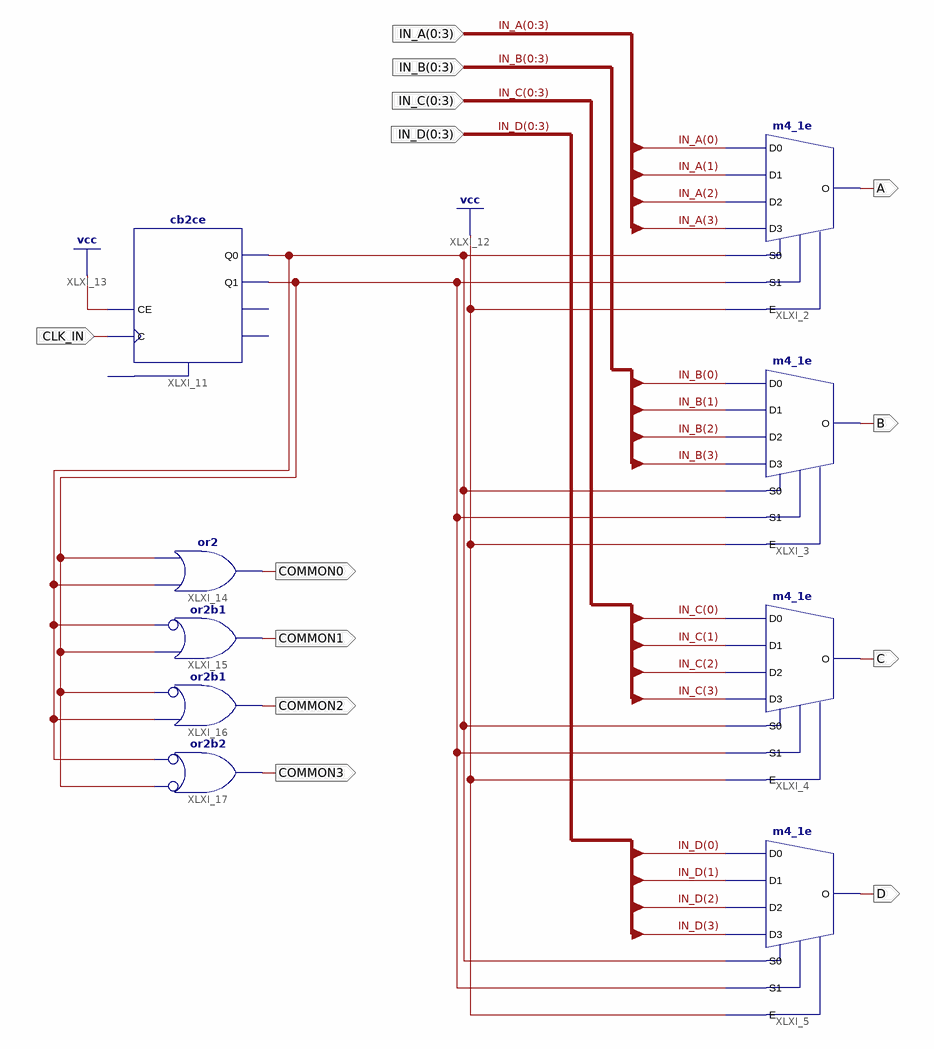
[diagram p0: schematic sheet 1]
// Xilinx ISE schematic CommonSelect.sch (spartan6) as structural Verilog: 9 symbols, 13 ports
module CommonSelect (
  input  [0:3] IN_A,
  input  [0:3] IN_B,
  input  [0:3] IN_D,
  input  [0:3] IN_C,
  input  CLK_IN,
  output COMMON0,
  output COMMON1,
  output COMMON2,
  output COMMON3,
  output A,
  output B,
  output C,
  output D
);

  wire XLXN_34, XLXN_36;

  m4_1e XLXI_3 (.D0(IN_B[0]), .D1(IN_B[1]), .D2(IN_B[2]), .D3(IN_B[3]), .E(1'b1), .S0(XLXN_34), .S1(XLXN_36), .O(B));
  m4_1e XLXI_2 (.D0(IN_A[0]), .D1(IN_A[1]), .D2(IN_A[2]), .D3(IN_A[3]), .E(1'b1), .S0(XLXN_34), .S1(XLXN_36), .O(A));
  m4_1e XLXI_5 (.D0(IN_D[0]), .D1(IN_D[1]), .D2(IN_D[2]), .D3(IN_D[3]), .E(1'b1), .S0(XLXN_34), .S1(XLXN_36), .O(D));
  m4_1e XLXI_4 (.D0(IN_C[0]), .D1(IN_C[1]), .D2(IN_C[2]), .D3(IN_C[3]), .E(1'b1), .S0(XLXN_34), .S1(XLXN_36), .O(C));
  cb2ce XLXI_11 (.C(CLK_IN), .CE(1'b1), .Q0(XLXN_34), .Q1(XLXN_36));  // open: CLR, CEO, TC
  or XLXI_14 (COMMON0, XLXN_36, XLXN_34);
  or XLXI_15 (COMMON1, ~XLXN_34, XLXN_36);  // or2b1
  or XLXI_16 (COMMON2, ~XLXN_36, XLXN_34);  // or2b1
  or XLXI_17 (COMMON3, ~XLXN_34, ~XLXN_36);  // or2b2
endmodule
